# Altium schematic sheet POWER.SchDoc: POWER
size 420 x 297 mm; DrawnBy: Hung Vo; SheetNumber: 5; SheetTotal: 6; MasterProject: BTL TKHTN
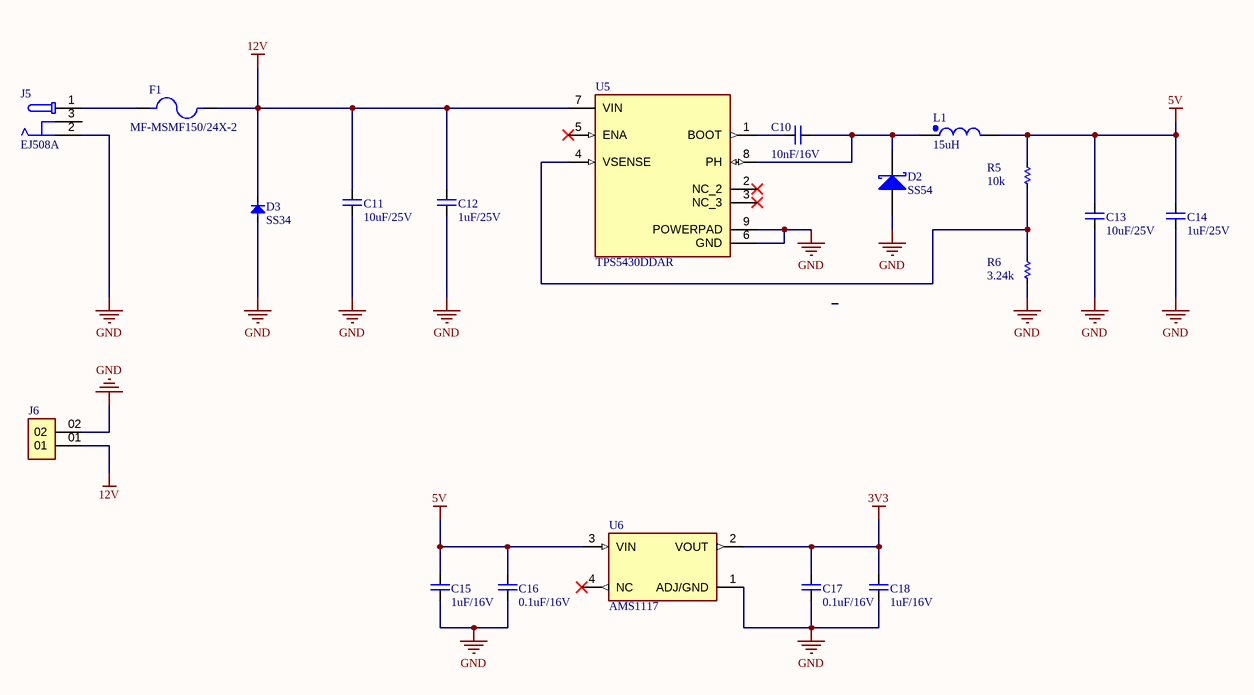
[diagram p0: POWER.SchDoc]

## Parts
C10  10nF/16V  [CAP_C_1608X80]
C11  10uF/25V  [CAP_C_1608X80]
C12  1uF/25V  [CAP_C_1608X80]
C13  10uF/25V  [CAP_C_1608X80]
C14  1uF/25V  [CAP_C_1608X80]
C15  1uF/16V  [CAP_C_1608X80]
C16  0.1uF/16V  [CAP_C_1608X80]
C17  0.1uF/16V  [CAP_C_1608X80]
C18  1uF/16V  [CAP_C_1608X80]
D2  SS54  [DO-214AC_SMA]
D3  SS34  [DO-214AC_SMA]
F1  MF-MSMF150/24X-2  [FUSER_MF-MSMF150/24X-2]
J5  EJ508A  [MPD_EJ508A]
J6  MTSW-102-08-G-S-100-RA  [SAMTEC_MTSW-102-08-G-S-100-RA]  (value not drawn)
L1  15uH  [IND_CDRH127/LDNP-470MC_SUM]
R5  10k  [RES_C_1608X60]
R6  3.24k  [RES_C_1608X60]
U5  TPS5430DDAR  [CONV_TPS5430DDAR]
U6  AMS1117  [SOT229P700X180-4N]

## Nets
3V3: C17.2 C18.2 U6.2(VOUT)
5V: C13.2 C14.2 C15.2 C16.2 L1.2 R5.1 U6.3(VIN)
12V: C11.2 C12.2 D3.1(K) F1.2 J6.01 U5.7(VIN)
GND: C11.1 C12.1 C13.1 C14.1 C15.1 C16.1 C17.1 C18.1 D2.1(A) D3.2(A) J5.2 J6.02 R6.2 U5.6(GND) U5.9(POWERPAD) U6.1(ADJ/GND)
NetC10_1: C10.1 D2.2(K) L1.1 U5.8(PH)
NetC10_2: C10.2 U5.1(BOOT)
NetF1_1: F1.1 J5.1
NetR5_2: R5.2 R6.1 U5.4(VSENSE)

Not connected (* = marked no-connect by the designer): J5 3; U5 2(NC_2)* 3(NC_3)* 5(ENA)*; U6 4(NC)*

## Notes on the sheet
- Sub-system:
- Project:
- Design by:
- Sheet title:
- Sheet
- of
- Checked by:
- Approved by:
- Doc No:
- Revision:
- Size:
- Date:
- A3

## Library data of the parts
C10-C18 = CAP_SMD: CAP_Chip; Value: 33pF
D2 = SS54: DIODE SCHOTTKY 40V 5A SMA; MPN: SS34; Solder: SMT; Value: SS34; MFR: *
D3 = Diode SMD: Default Diode; Code - JEDEC: DO-214-AB; Value: 1N5007; Published: 8-Jun-2000; Revision: July-2002: Re-released for DXP Platform.; Publisher: Altium Limited
F1 = MF-MSMF150/24X-2: Polymeric PTC Resettable Fuse 24V 1.5 A Ih Surface Mount 1812 (4532 Metric), Concave; MF: Bourns; Check_prices: https://www.snapeda.com/parts/MF-MSMF150/24X-2/Bourns/view-part/?ref=eda; Value: *; MP: MF-MSMF150/24X-2; Purchase-URL: https://pricing.snapeda.com/search/part/MF-MSMF150/24X-2/?ref=eda; SnapEDA_Link: https://www.snapeda.com/parts/MF-MSMF150/24X-2/Bourns/view-part/?ref=snap; Package: 1812 Bourns; Digi-Key_Part_Number: MF-MSMF150/24X-2TR-ND
J5 = EJ508A: Power Barrel Connector Jack 2.10mm ID _0.083_, 5.50mm OD _0.217_ Through Hole, Right Angle; MF: MPD; Package: Non-Standard MPD; Value: *; SnapEDA_Link: https://www.snapeda.com/parts/EJ508A/MPD%20%28Memory%20Protection%20Devices%29/view-part/474399/?ref=snap; Price: None; MP: EJ508A; Availability: Unavailable
J6 = MTSW-102-08-G-S-100-RA: Connector Header Through Hole, Right Angle 2 position 0.100 (2.54mm); MF: Samtec; SnapEDA_Link: https://www.snapeda.com/parts/MTSW-102-08-G-S-100-RA/Samtec/view-part/?ref=snap; Package: None; Value: *; MP: MTSW-102-08-G-S-100-RA; Check_prices: https://www.snapeda.com/parts/MTSW-102-08-G-S-100-RA/Samtec/view-part/?ref=eda
L1 = _IND
R5 R6 = _RES_B_2: RES
U5 = TPS5430DDAR: 5.5V to 36V Input, 3A, 500kHz Step-Down Converter; MF: Texas Instruments; Package: HSOIC-8 Texas Instruments; Check_prices: https://www.snapeda.com/parts/TPS5430DDAR/Texas+Instruments/view-part/?ref=eda; Value: *; Purchase-URL: https://pricing.snapeda.com/search/part/TPS5430DDAR/?ref=eda; Availability: In Stock; SnapEDA_Link: https://www.snapeda.com/parts/TPS5430DDAR/Texas+Instruments/view-part/?ref=snap; MP: TPS5430DDAR; Price: None
U6 = AMS1117: 1A LOW DROPOUT VOLTAGE REGULATOR SOT-223; MF: Advanced Monolithic Systems; SnapEDA_Link: https://www.snapeda.com/parts/AMS1117/Advanced+Monolithic+Systems/view-part/?ref=snap; Package: SOT-223 Seeed Technology; Value: *; MP: AMS1117; Check_prices: https://www.snapeda.com/parts/AMS1117/Advanced+Monolithic+Systems/view-part/?ref=eda